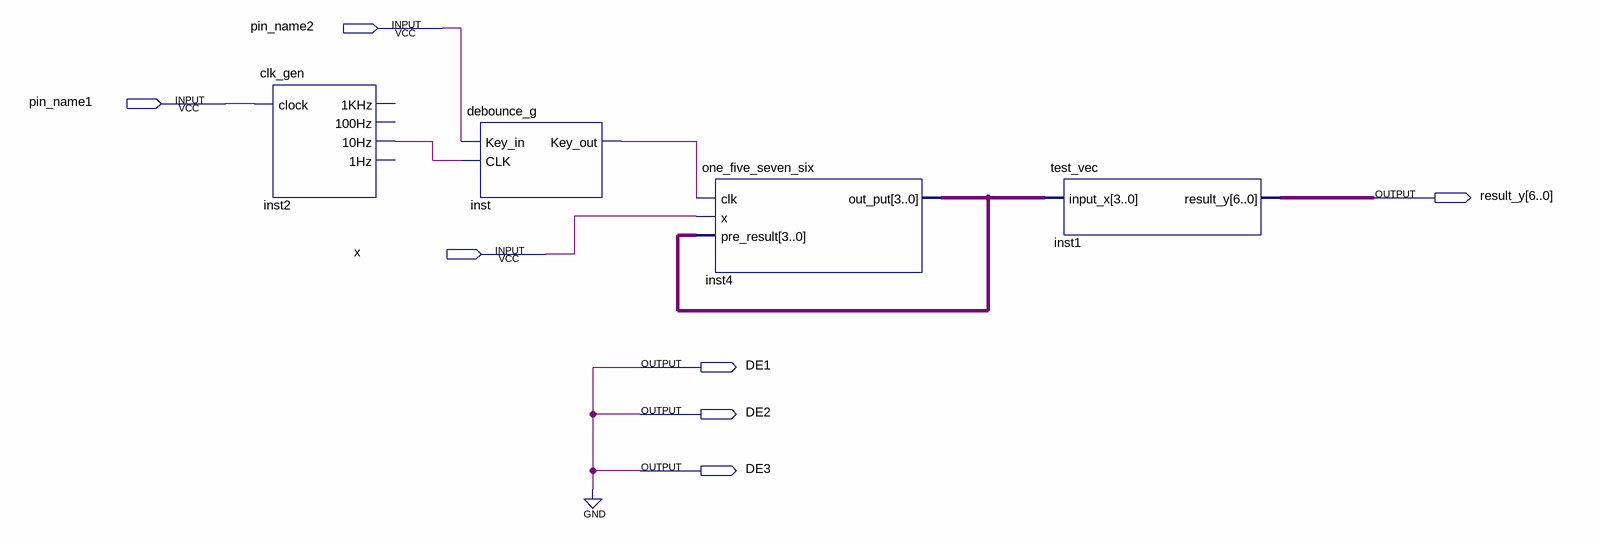
[diagram p0: schematic sheet]
// Quartus schematic moore_test.bdf as structural Verilog: 4 symbols, 7 pins
module moore_test (
  input  pin_name2,
  input  pin_name1,
  input  x,
  output [6:0] result_y,
  output DE1,
  output DE2,
  output DE3
);

  wire inst2_10hz, inst_key_out;
  wire [3:0] inst4_out_put;

  clk_gen inst2 (.clock(pin_name1), .\10Hz (inst2_10hz));  // open: 1KHz, 100Hz, 1Hz
  debounce_g inst (.Key_in(pin_name2), .CLK(inst2_10hz), .Key_out(inst_key_out));
  one_five_seven_six inst4 (.clk(inst_key_out), .x(x), .pre_result(inst4_out_put), .out_put(inst4_out_put));
  test_vec inst1 (.input_x(inst4_out_put), .result_y(result_y));

  assign DE1 = 1'b0;
  assign DE2 = 1'b0;
  assign DE3 = 1'b0;
endmodule
